# EAGLE design Grove - I2C ADC (EAGLE 6.3)
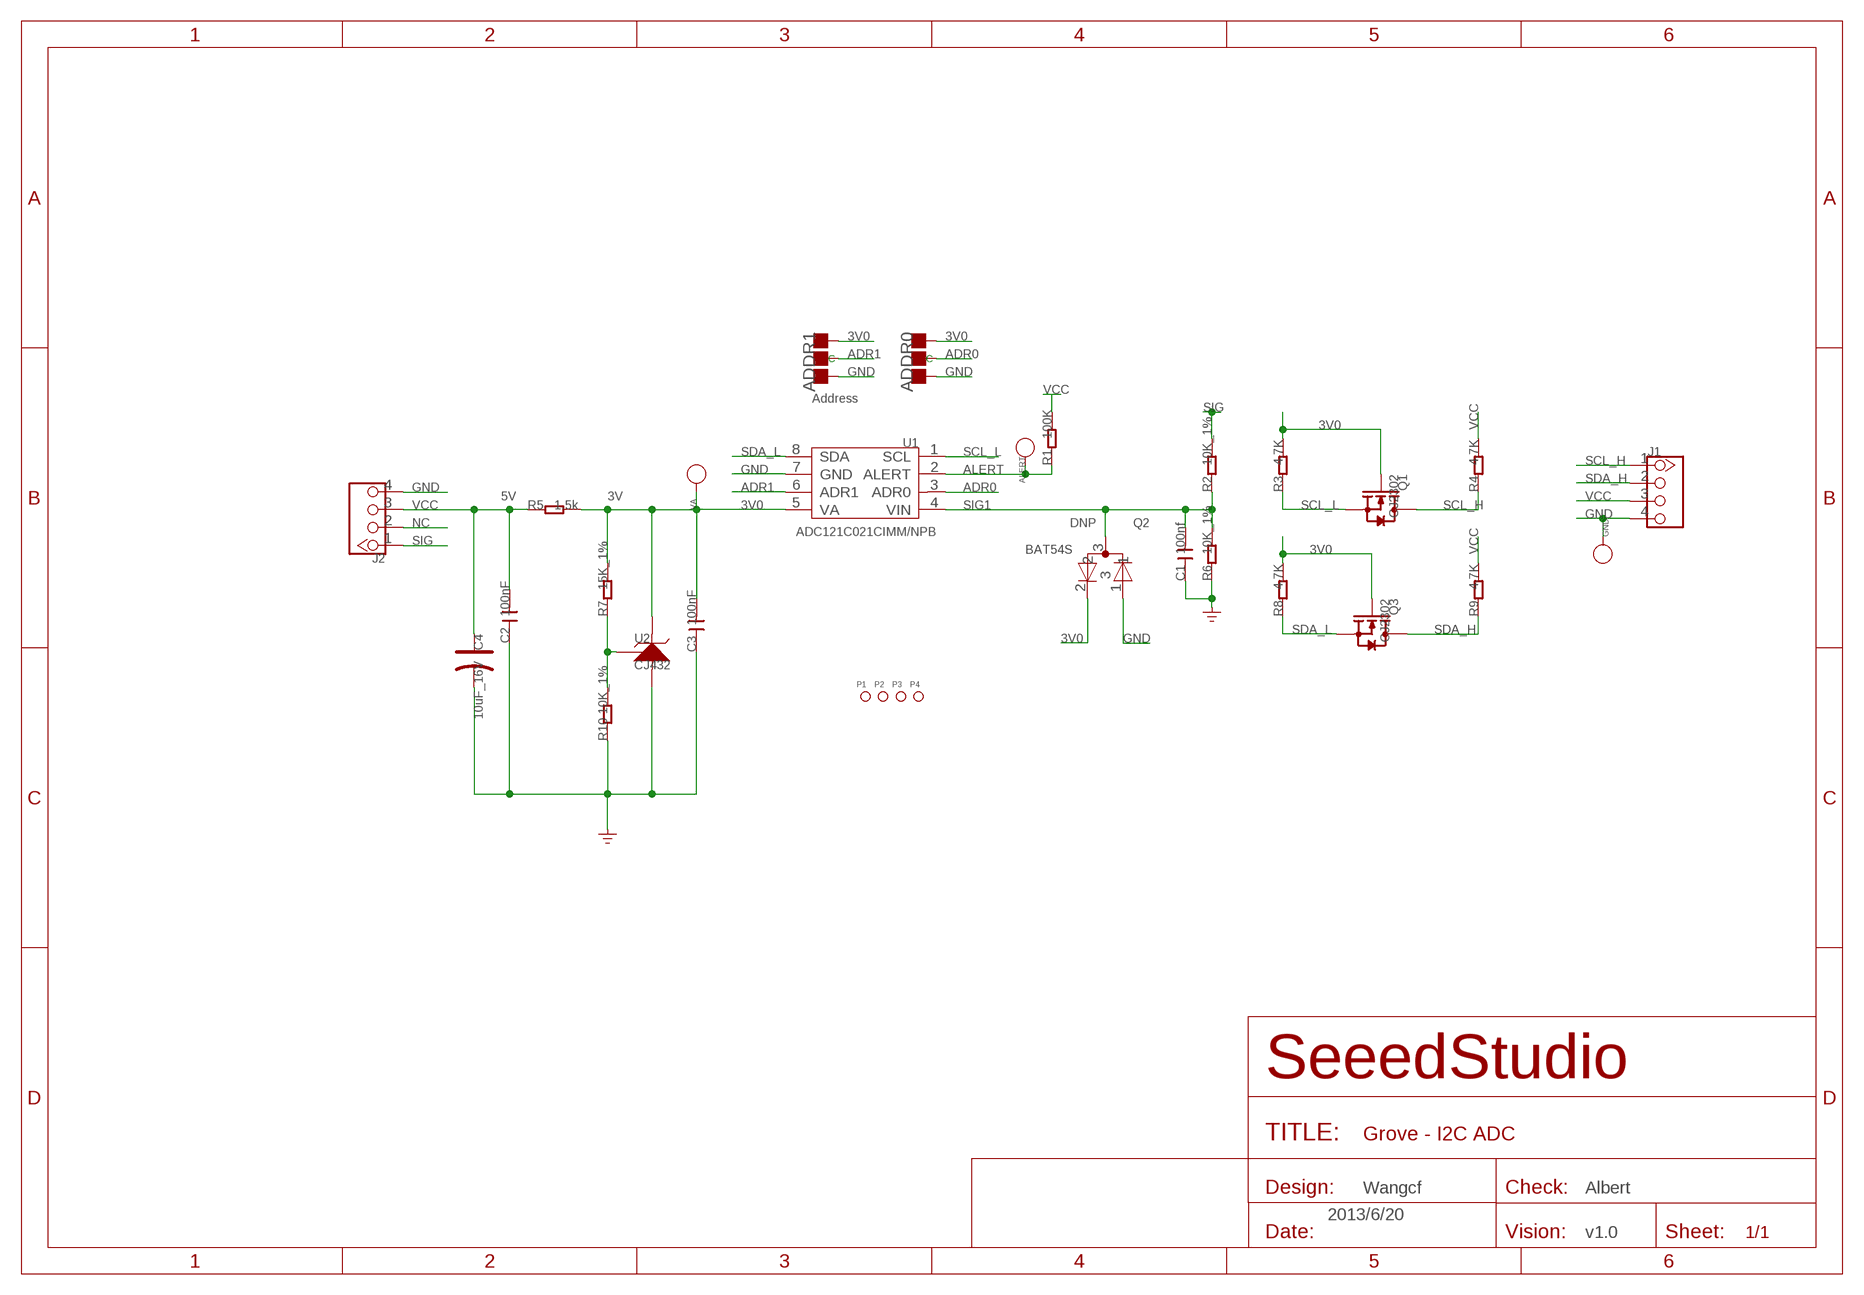
[diagram p0: schematic, sheet 1]

## Parts
ADDR0  DNP  PAD-JUMPER-3P-40*40  [3P-SMD-4.1X1.5]
ADDR1  DNP  PAD-JUMPER-3P-40*40  [3P-SMD-4.1X1.5]
ALERT  DNP  PAD-TEST-POINT-CIRCLE'3535'  [TP_3535]
C1  100nf  C-0603  [C0603]
C2  100nF  C-0603  [C0603]
C3  100nF  C-0603  [C0603]
C4  10uF_16V  CAP-AVX-A  [AVX-A]
GND  DNP  PAD-TEST-POINT-CIRCLE'3535'  [TP_3535]
J1  TWIG-4P-2.0-2.0  [4P-2.0]
J2  TWIG-4P-2.0-2.0  [4P-2.0]
P1  PAD-MARK  [ROUND-MARK-1.0]
P2  PAD-MARK  [ROUND-MARK-1.0]
P3  PAD-MARK  [ROUND-MARK-1.0]
P4  PAD-MARK  [ROUND-MARK-1.0]
Q1  CJ2302  MOSFET-N'SOT23'  [SOT23]
Q2  DNP  BAV99  [SOT23]
Q3  CJ2302  MOSFET-N'SOT23'  [SOT23]
R1  100K  R-0603  [R0603]
R2  10K_1%  R-0603  [R0603]
R3  4.7K  R-0603  [R0603]
R4  4.7K  R-0603  [R0603]
R5  1.5k  R-0603  [R0603]
R6  10K_1%  R-0603  [R0603]
R7  15K_1%  R-0603  [R0603]
R8  4.7K  R-0603  [R0603]
R9  4.7K  R-0603  [R0603]
R10  10K_1%  R-0603  [R0603]
U1  ADC121C021CIMM/NPB  ADC121C021'CIMM/NP8'  [MSOP8]
U2  CJ432  REFERENCE-SOURCE  [SOT23]
VA  DNP  PAD-TEST-POINT-CIRCLE'3535'  [TP_3535]

## Nets
3V0: ADDR0.11(R) ADDR1.11(R) C3.2 Q1.1(G) Q2.2 Q3.1(G) R3.2 R5.2 R7.2 R8.2 U1.5(VA) U2.2(K) VA.T
ADR0: ADDR0.MM(C) U1.3(ADR0)
ADR1: ADDR1.MM(C) U1.6(ADR1)
ALERT: ALERT.T R1.1 U1.2(ALERT)
GND: ADDR0.00(L) ADDR1.00(L) C1.1 C2.1 C3.1 C4.- GND.T J1.4 J2.4 Q2.1 R6.1 R10.1 U1.7(GND) U2.3(A)
N$1: R1.2
N$5: R7.1 R10.2 U2.1(R)
NC: J2.2
SCL_H: J1.1 Q1.3(D) R4.1
SCL_L: Q1.2(S) R3.1 U1.1(SCL)
SDA_H: J1.2 Q3.3(D) R9.1
SDA_L: Q3.2(S) R8.1 U1.8(SDA)
SIG: J2.1 R2.2
SIG1: C1.2 Q2.3 R2.1 R6.2 U1.4(VIN)
VCC: C2.2 C4.+ J1.3 J2.3 R4.2 R5.1 R9.2

## Notes on the sheet
- Address
- 5V | 3V
- BAT54S
- Wangcf | Albert
- 2013/6/20
- v1.0

## Library data of the parts
ADDR0 ADDR1 = Discrete:PAD-JUMPER-3P; PARTNO: DNP
ALERT GND VA = Discrete:PAD-TEST-POINT-CIRCLE; PARTNO: DNP
C1-C3 = Discrete:C*: Ceramic Capacitors
C4 = Discrete1:CAP*: Electrolytic Capacitors,Tantalum Capacitors and Super Capacitors
J1 J2 = Connector :TWIG-4P-2.0
P1-P4 = Discrete:PAD-MARK; PARTNO: DNP
Q1 Q3 = Discrete:MOSFET-N: IRLL014: http://www.vishay.com/docs/91319/sihll014.pdf
Q2 = template:BAV99
R1-R10 = Discrete:R*
U1 = IC:ADC121C021: ADC121C021/ADC121C021Q/ADC121C027 I2C-Compatible, 12-Bit Analog-to-Digital Converter with Alert Function
U2 = For_Test_Albert_v6:REFERENCE-SOURCE: CJ432,AZ432 or other Adjustable Reference Source

## Board
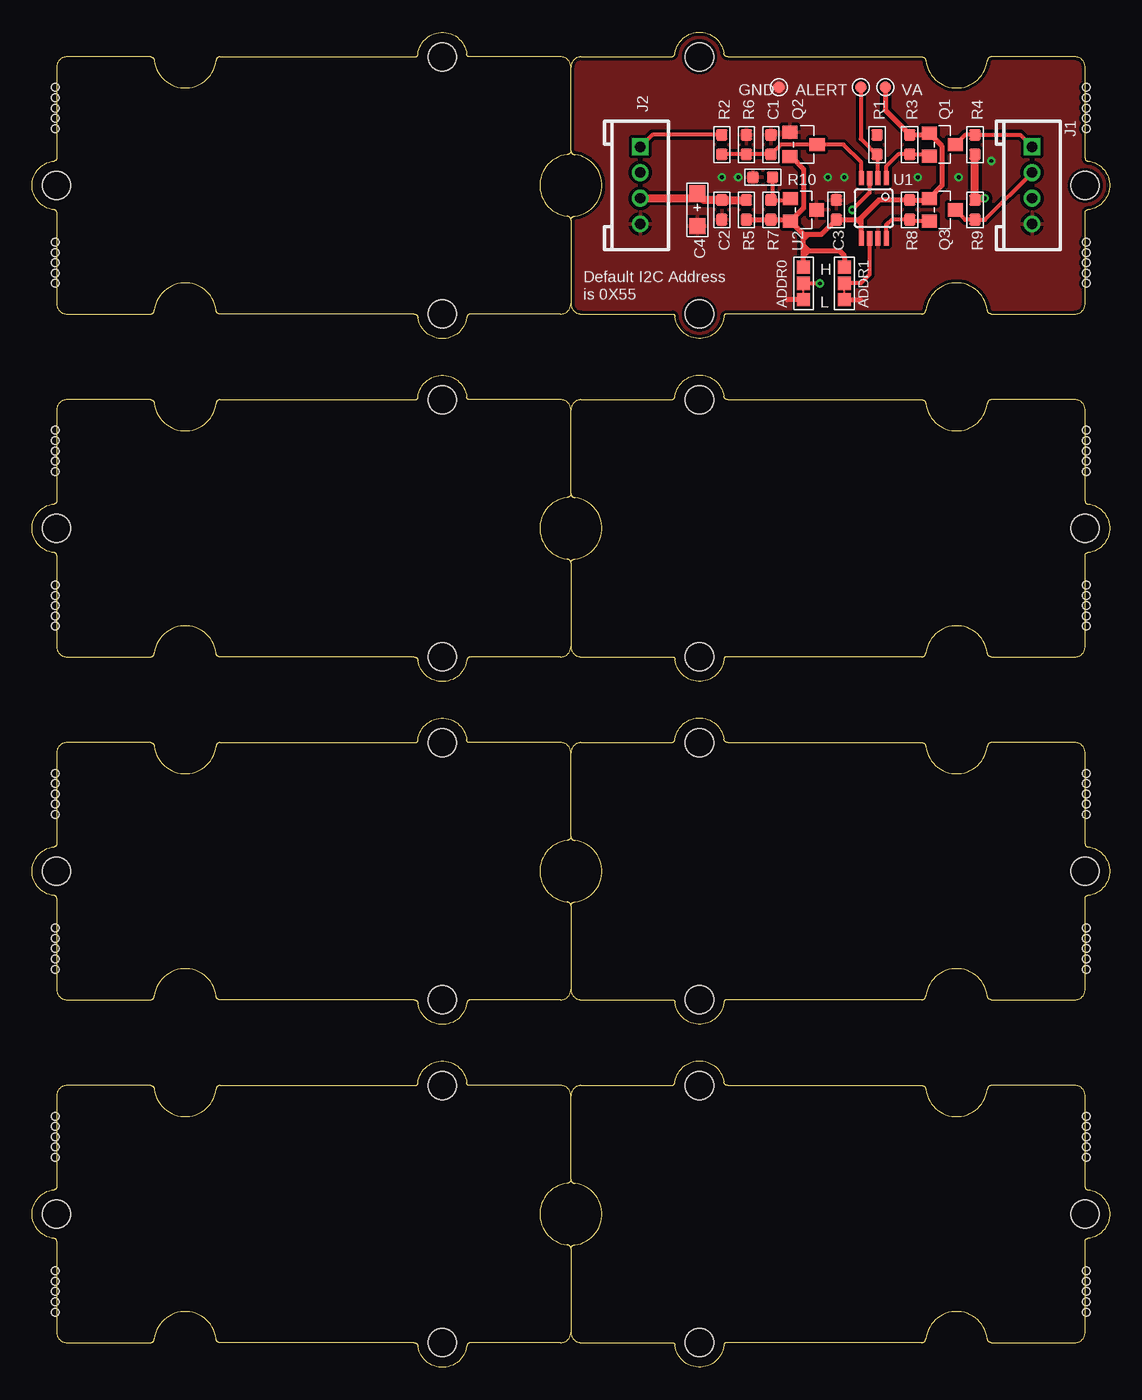
[diagram p1: board, top side]
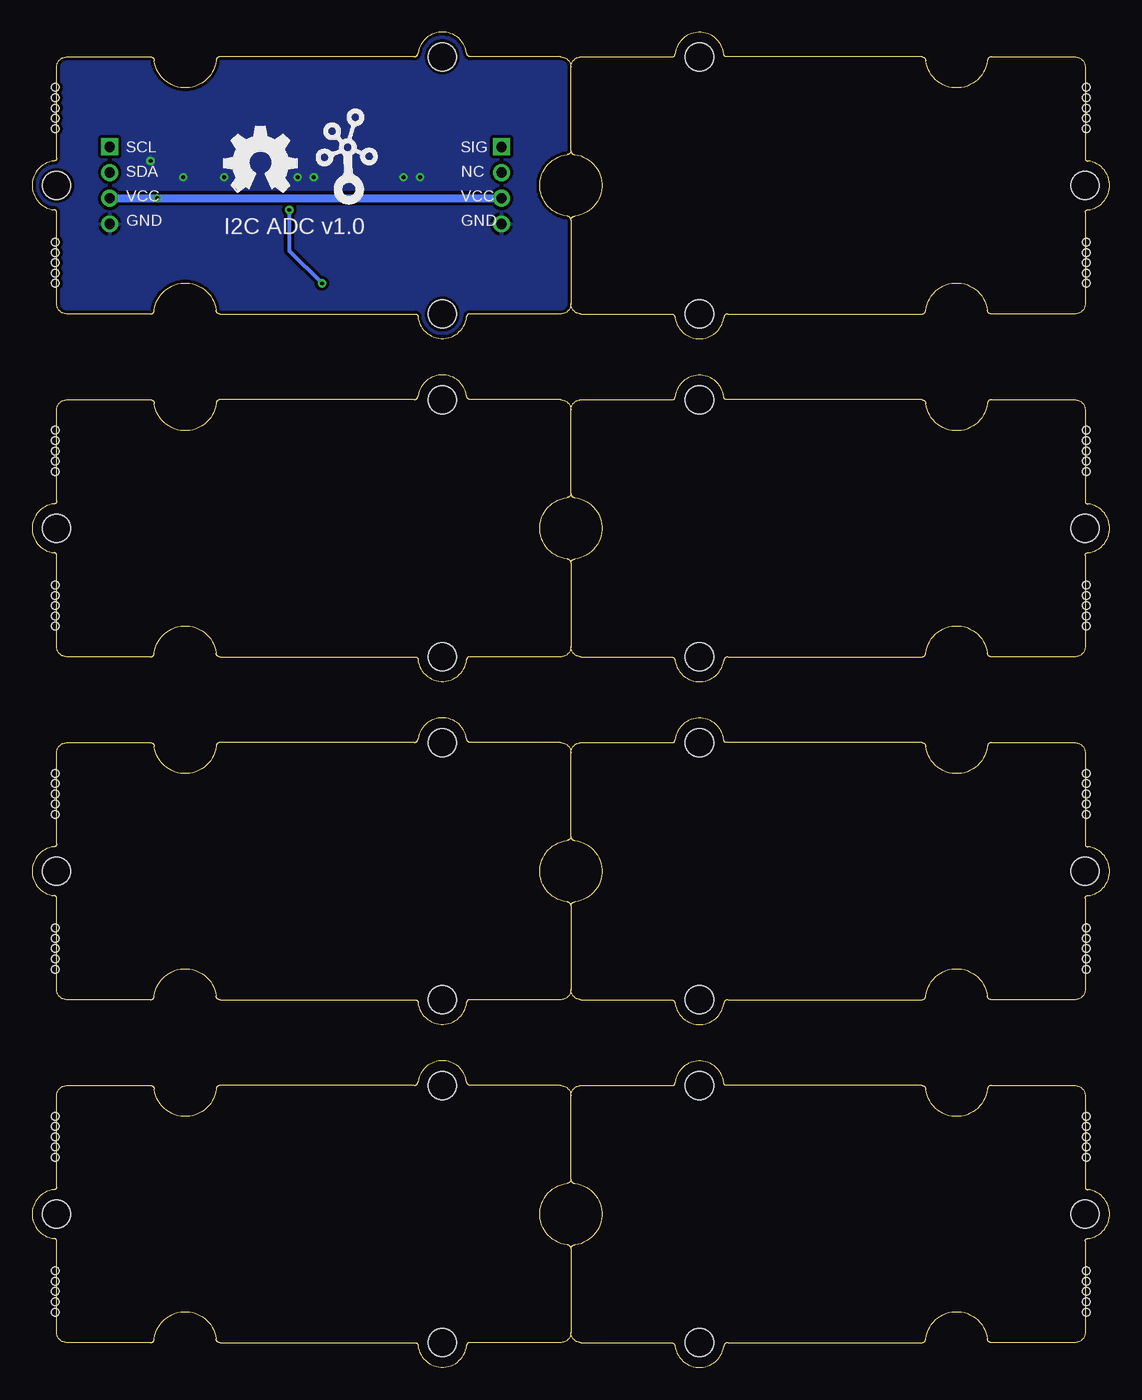
[diagram p2: board, bottom side, seen from below]

Size 83.82 x 103.85 mm. Coordinates in mm from the lower left corner, seen from the top.
Copper layers (1*16): Top 0.035mm / dielectric 1.5mm / Bottom 0.035mm
Design rules "SeeedStudio_DRU_no_angle_20130527 *": minimum track width 6mil, minimum drill 12mil, track to track 6mil, track to pad 6mil, pad to pad 6mil, via to via 6mil, smd to smd 0mil, copper to edge 10mil, drill to drill 10mil, minimum pad ring 10mil, minimum via ring 6mil, stop-mask expansion 2mil, vias tented up to drill 25mil, thermal gap 10mil
Holes 2.03 mm at -4.77,100.19 -4.77,3.67 88.58,3.67 88.58,100.19
Holes 0.6 mm at 1.8,99.55 1.8,98.75 1.8,97.95 1.8,97.15 1.8,96.35 1.8,84.31 1.8,85.11 1.8,85.91 1.8,86.71 1.8,87.51 1.8,72.88 1.8,72.08 1.8,71.28 1.8,70.48 1.8,69.68 1.8,57.64 1.8,58.44 1.8,59.24 1.8,60.04 1.8,60.84 1.8,46.21 1.8,45.41 1.8,44.61 1.8,43.81 1.8,43.01 1.8,30.97 1.8,31.77 1.8,32.57 1.8,33.37 1.8,34.17 1.8,19.54 1.8,18.74 1.8,17.94 1.8,17.14 1.8,16.34 1.8,4.3 1.8,5.1 1.8,5.9 1.8,6.7 1.8,7.5 82.01,4.3 82.01,5.1 82.01,5.9 82.01,6.7 82.01,7.5 82.01,19.54 82.01,18.74 82.01,17.94 82.01,17.14 82.01,16.34 82.01,30.97 82.01,31.77 82.01,32.57 82.01,33.37 82.01,34.17 82.01,46.21 82.01,45.41 82.01,44.61 82.01,43.81 82.01,43.01 82.01,57.64 82.01,58.44 82.01,59.24 82.01,60.04 82.01,60.84 82.01,72.88 82.01,72.08 82.01,71.28 82.01,70.48 82.01,69.68 82.01,84.31 82.01,85.11 82.01,85.91 82.01,86.71 82.01,87.51 82.01,99.55 82.01,98.75 82.01,97.95 82.01,97.15 82.01,96.35

### Footprints (pad centres in the part's own frame; a part is rotated, then mirrored left to right if it is on the bottom)
3P-SMD-4.1X1.5 = smd 1.016 x 1.016: 00 -1.27,0; 11 1.27,0; MM 0,0
TP_3535 = smd 0.889 x 0.889: T 0,0
C0603 = smd 0.889 x 0.889: 1 -0.762,0; 2 0.762,0
AVX-A = smd 1.27 x 1.27: + -1.27,0; - 1.27,0
4P-2.0 = drill 0.8 pad 1.27 square: 1 -3,0 | drill 0.8 pad 1.27: 2 -1,0; 3 1,0; 4 3,0
ROUND-MARK-1.0 = smd 1.016 x 1.016: P$1 0,0
SOT23 = smd 1.016 x 1.143: 1 -0.889,-1.016; 2 0.889,-1.016; 3 0,1.016
SOT23' = smd 1.016 x 1.2: 1 -0.95,-1.06; 2 0.95,-1.06; 3 0,1.06
R0603 = smd 0.889 x 0.889: 1 -0.762,0; 2 0.762,0
MSOP8 = smd 1.1 x 0.4: 1 -2.477,0.975; 2 -2.477,0.325; 3 -2.477,-0.325; 4 -2.477,-0.975; 5 2.223,-0.975; 6 2.223,-0.325; 7 2.223,0.325; 8 2.223,0.975
2U-DIM-W/DRILL = hole 2.2: -10,-10; -10,10; 20,0

### Placement (x,y rotation side)
ADDR0  60,84.31 90 top
ADDR1  63.18,84.31 90 top
ALERT  64.45,99.55 0 top
C1  57.46,95.11 270 top
C2  53.65,90.03 90 top
C3  62.54,90.03 270 top
C4  51.75,90.03 270 top
GND  58.1,99.55 0 top
J1  77.78,91.93 270 top
J2  47.3,91.93 270 top
P1  -4.77,96.38 0 top  (outside the outline)
P2  88.58,96.38 0 top  (outside the outline)
P3  -4.77,8.11 0 top  (outside the outline)
P4  88.58,8.11 0 top  (outside the outline)
Q1  70.8,95.11 270 top
Q2  DNP  [SOT23']  60,95.11 270 top
Q3  70.8,90.03 270 top
R1  65.72,95.11 90 top
R2  53.65,95.11 90 top
R3  68.26,95.11 90 top
R4  73.34,95.11 270 top
R5  55.56,90.03 270 top
R6  55.56,95.11 270 top
R7  57.46,90.03 270 top
R8  68.26,90.03 90 top
R9  73.34,90.03 90 top
R10  56.83,92.57 0 top
U1  65.46,90.03 270 top
U2  60,90.03 270 top
U$4  [2U-DIM-W/DRILL]  61.91,91.93 0 top
U$5  [OSHW_FILLX200_NOTEXT]  68.89,91.42 0 bottom
U$6  [TWIGLOGO]  59.24,91.42 0 bottom
U$7  [2U-DIM-W/DRILL]  21.91,91.93 180 top
U$8  [2U-DIM-W/DRILL]  61.91,65.26 0 top
U$9  [2U-DIM-W/DRILL]  21.91,65.26 180 top
U$10  [2U-DIM-W/DRILL]  21.91,38.59 180 top
U$11  [2U-DIM-W/DRILL]  61.91,38.59 0 top
U$12  [2U-DIM-W/DRILL]  21.91,11.92 180 top
U$13  [2U-DIM-W/DRILL]  61.91,11.92 0 top
VA  66.35,99.55 0 top

### Tracks (layer width: path | path; a pad name or v marks a point on that pad's centre or on a via)
3V0
  Top 0.406: R5.2 R7.2 58.86,89.26 U2.2 | U2.2 60,88.12 | 60,88.12 60.38,88.12 | 60.38,88.12 61.4,88.12 C3.2 64.19,89.26 | 64.45,89.39 65.85,90.79 R8.2 69.66,90.79 Q3.1 70.8,91.93 70.8,94.98 Q1.1 69.66,95.87 R3.2 | U1.5 64.49,89.26 | 64.49,89.26 64.49,89.35 64.45,89.39 | 64.32,89.26 64.49,89.26 | 64.19,89.26 64.45,89.01 | Q2.2 59.05,94.16 60,93.2 60,90.15 U2.2 | 64.19,89.26 64.32,89.26 | 64.32,89.26 64.45,89.39 | VA.T 66.35,97.77 R3.2 | 68.39,95.74 R3.2 | 60,86.85 60.38,86.85 | 60.38,86.85 62.78,86.85 63.18,86.45 ADDR1.11 | ADDR0.11 60,86.47 | 60,86.47 60,86.85 | 60,86.85 60,87.23 | 60,87.23 60,87.74 | 60,87.74 60,88.12 | 60.38,86.85 60,86.47 | 60.38,86.85 60,87.23 | 60,87.74 60.38,88.12
ADR0  (via drill 0.3 pad 0.64)
  Top 0.305: U1.3 65.14,91.35 v63.81,90.03 | ADDR0.MM v61.27,84.31
  Bottom 0.305: v63.81,90.03 63.81,86.85 v61.27,84.31
ADR1
  Top 0.305: U1.6 65.14,85 64.45,84.31 ADDR1.MM
ALERT
  Top 0.305: U1.2 65.79,94.22 | 65.79,94.22 65.79,94.27 R1.1 | ALERT.T 64.45,95.56 65.79,94.22
GND  (via drill 0.3 pad 0.64)
  Top 0.152: ADDR0.00 60,84.31 | ADDR1.00 63.18,84.31
  Top 0.406: ADDR0.00 58.73,83.04 | ADDR1.00 64.45,83.04
  other vias: 61.91,92.57 63.18,92.57 68.89,92.57 54.92,92.57 53.65,92.57 72.07,92.57 74.61,93.84
  pour Top (isolate 0.254): 41.59,79.87 84.13,79.87 84.13,104 41.59,104 41.59,79.99
  pour Bottom (isolate 0.254): 41.59,79.87 84.13,79.87 84.13,104 41.59,104 41.59,79.99
N$5
  Top 0.305: R10.2 57.59,90.92 R7.1 58.86,90.79 U2.1
SCL_H
  Top 0.305: J1.1 76.85,95.87 R4.1 72.58,95.87 Q1.3
SCL_L
  Top 0.305: Q1.2 69.66,94.34 R3.1 67.37,94.34 66.61,93.58 66.48,93.46 66.44,93.41 U1.1
SDA_H
  Top 0.305: J1.2 74.12,89.26 R9.1 72.58,89.26 Q3.3
SDA_L
  Top 0.305: Q3.2 68.39,89.14 R8.1 66.86,89.26 66.54,88.95 66.48,88.88 66.44,88.84 U1.8
SIG
  Top 0.305: R2.2 48.24,95.87 J2.1
SIG1
  Top 0.305: R2.1 R6.2 C1.2 58.23,95.11 Q2.3 63.11,95.11 64.49,93.73 U1.4
VCC  (via drill 0.3 pad 0.64)
  Top 0.61: R5.1 C2.2 52.26,90.79 52.07,90.98 | R9.2 73.34,90.92 | 73.34,90.92 R4.2 | 52.07,90.98 C4.+ | J2.3 52.02,90.93 52.07,90.98 | 73.34,90.92 73.35,90.93 v74.1,90.93
  Bottom 0.61: J1.3 v74.1,90.93 73.59,90.93 J2.3

### Text on the board
tPlace: H | Default I2C Address / is 0X55 | L
bPlace: SIG | SCL | NC | SDA | VCC | VCC | GND | GND | I2C ADC v1.0